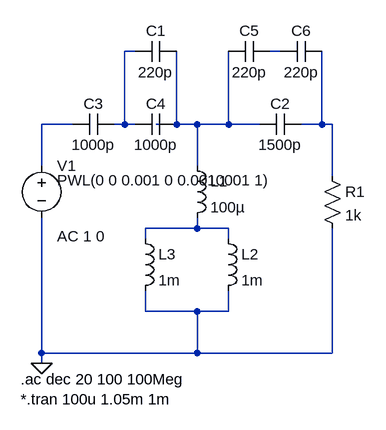
[diagram p0: schematic 4_butter_hpf.asc]
4_butter_hpf.asc, the LTspice schematic file:
Version 4
SHEET 1 972 680
WIRE 160 -32 144 -32
WIRE 384 -32 368 -32
WIRE 64 80 16 80
WIRE 144 80 144 -32
WIRE 144 80 128 80
WIRE 160 80 144 80
WIRE 224 80 224 -32
WIRE 224 80 192 80
WIRE 256 80 224 80
WIRE 304 80 304 -32
WIRE 304 80 256 80
WIRE 352 80 304 80
WIRE 448 80 448 -32
WIRE 448 80 416 80
WIRE 464 80 448 80
WIRE 16 144 16 80
WIRE 256 144 256 80
WIRE 464 160 464 80
WIRE 256 240 256 224
WIRE 256 240 176 240
WIRE 304 240 256 240
WIRE 176 256 176 240
WIRE 304 256 304 240
WIRE 176 368 176 336
WIRE 256 368 176 368
WIRE 304 368 304 336
WIRE 304 368 256 368
WIRE 16 432 16 224
WIRE 256 432 256 368
WIRE 256 432 16 432
WIRE 464 432 464 240
WIRE 464 432 256 432
WIRE 16 448 16 432
FLAG 16 448 0
SYMBOL voltage 16 128 R0
WINDOW 123 24 124 Left 2
WINDOW 39 0 0 Left 2
WINDOW 3 24 38 Left 2
SYMATTR Value2 AC 1 0
SYMATTR Value PWL(0 0 0.001 0 0.0010001 1)
SYMATTR InstName V1
SYMBOL res 448 144 R0
SYMATTR InstName R1
SYMATTR Value 1k
SYMBOL cap 224 -48 R90
WINDOW 0 0 32 VBottom 2
WINDOW 3 32 32 VTop 2
SYMATTR InstName C1
SYMATTR Value 220p
SYMBOL cap 416 64 R90
WINDOW 0 0 32 VBottom 2
WINDOW 3 32 32 VTop 2
SYMATTR InstName C2
SYMATTR Value 1500p
SYMBOL ind 240 128 R0
SYMATTR InstName L1
SYMATTR Value 100µ
SYMBOL cap 128 64 R90
WINDOW 0 0 32 VBottom 2
WINDOW 3 32 32 VTop 2
SYMATTR InstName C3
SYMATTR Value 1000p
SYMBOL cap 224 64 R90
WINDOW 0 0 32 VBottom 2
WINDOW 3 32 32 VTop 2
SYMATTR InstName C4
SYMATTR Value 1000p
SYMBOL cap 368 -48 R90
WINDOW 0 0 32 VBottom 2
WINDOW 3 32 32 VTop 2
SYMATTR InstName C5
SYMATTR Value 220p
SYMBOL ind 288 240 R0
SYMATTR InstName L2
SYMATTR Value 1m
SYMBOL cap 448 -48 R90
WINDOW 0 0 32 VBottom 2
WINDOW 3 32 32 VTop 2
SYMATTR InstName C6
SYMATTR Value 220p
SYMBOL ind 160 240 R0
SYMATTR InstName L3
SYMATTR Value 1m
TEXT -16 472 Left 2 !.ac dec 20 100 100Meg\n*.tran 100u 1.05m 1m

The netlist it stands for:
* 4_butter_hpf.asc
V1 N003 0 PWL(0 0 0.001 0 0.0010001 1) AC 1 0
R1 N005 0 1k
C1 N004 N001 220p
C2 N005 N004 1500p
L1 N004 N006 100µ
C3 N001 N003 1000p
C4 N004 N001 1000p
C5 N002 N004 220p
L2 N006 0 1m
C6 N005 N002 220p
L3 N006 0 1m
.ac dec 20 100 100Meg
*.tran 100u 1.05m 1m
.backanno
.end